# Altium schematic sheet soldeerstation_Schematic.SchDoc: Soldeerstation
size A4; Engineer: Oguzhan Guney
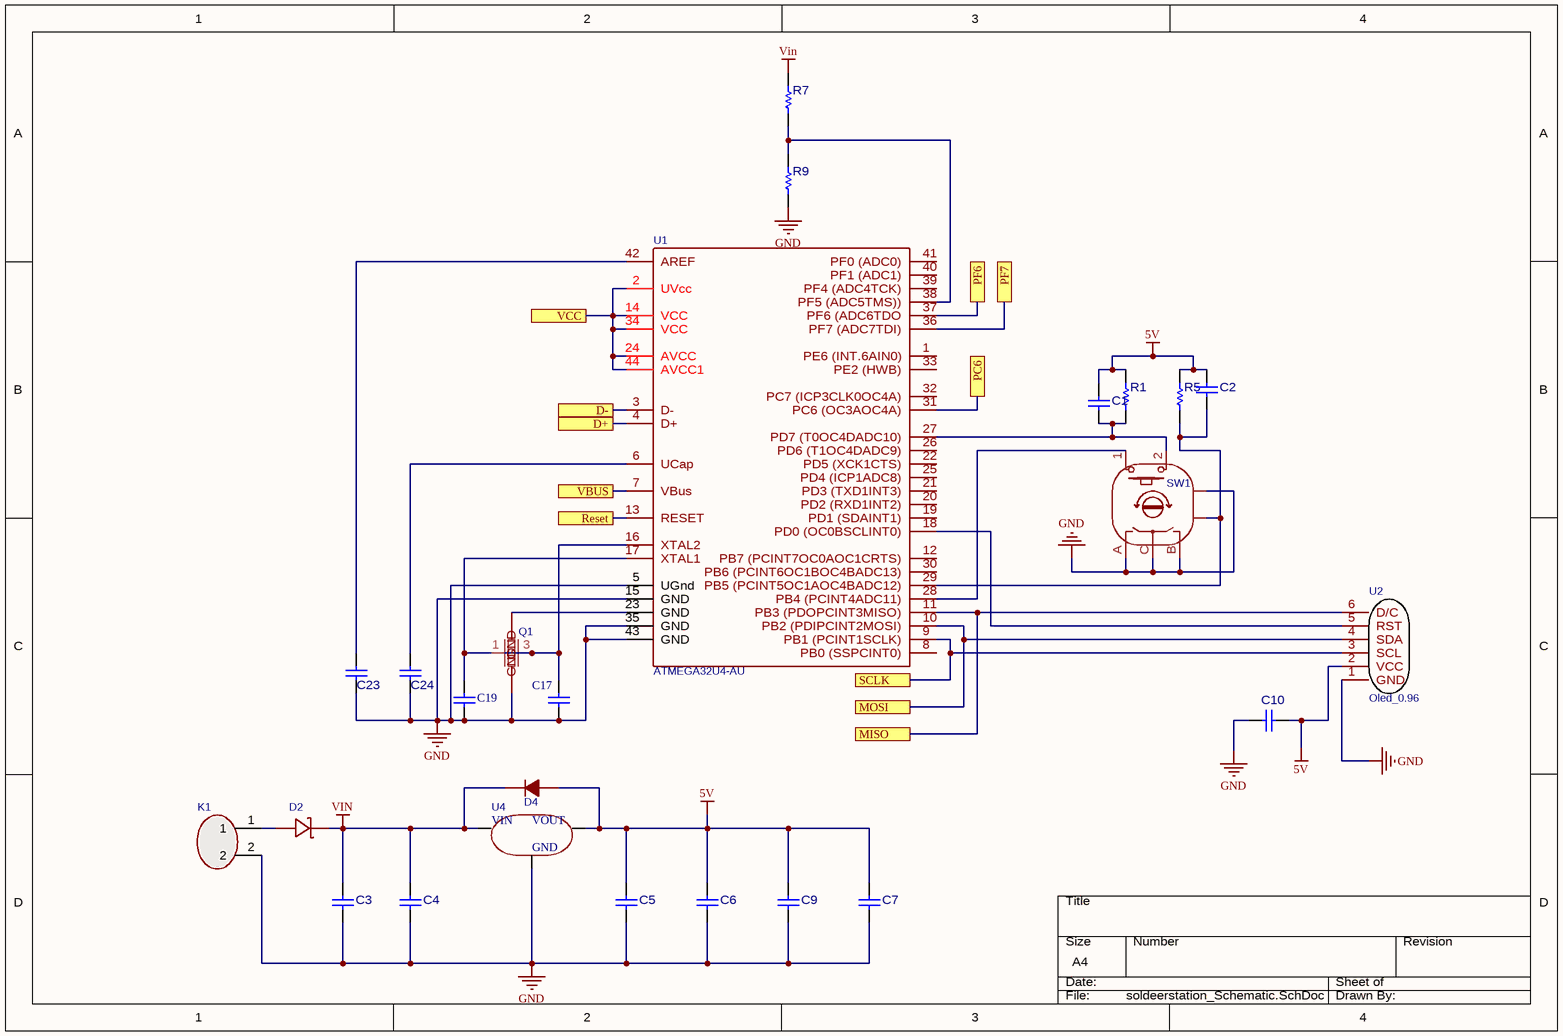
[diagram p0: soldeerstation_Schematic.SchDoc]

## Parts
C1  GRM188R71H103KA01D  [CAPC1608X90X35ML10T15]  (value not drawn)
C2  GRM188R71H103KA01D  [CAPC1608X90X35ML10T15]  (value not drawn)
C3  CL31B106KLHNNNE  [CAPC3216X180X50LL20T30]  (value not drawn)
C4  C0402C104K8PACTU  [CAPC1005X60X30ML05T10]  (value not drawn)
C5  C0402C104K8PACTU  [CAPC1005X60X30ML05T10]  (value not drawn)
C6  CAP 47uF 10V 1206(3216)  [CAPC1206(3216)190_N]  (value not drawn)
C7  C1206C106K8RACTU  [CAPC3216X180X50LL20T25]  (value not drawn)
C9  C0402C104K8PACTU  [CAPC1005X60X30ML05T10]  (value not drawn)
C10  C0402C104K8PACTU  [CAPC1005X60X30ML05T10]  (value not drawn)
C17  CAP 22pF 50V 0805(2012)  [CAPC0805(2012)100_L]  (value not drawn)
C19  CAP 22pF 50V 0805(2012)  [CAPC0805(2012)100_L]  (value not drawn)
C23  C0402C104K8PACTU  [CAPC1005X60X30ML05T10]  (value not drawn)
C24  12061C105KAT2A  [CAPC3216X180X50LL20T25]  (value not drawn)
D2  MBRS540T3G  [SMC]  (value not drawn)
D4  S1A  [SMA(DO-214AC)]  (value not drawn)
K1  WJ25C-B-2P  [WJ25C-B-7.62-2P]  (value not drawn)
Q1  KX-7  [KX-7]  (value not drawn)
R1  RC0603FR-0710KL  [RESC1608X55X25ML10T15]  (value not drawn)
R5  RC0603FR-0710KL  [RESC1608X55X25ML10T15]  (value not drawn)
R7  RC0603FR-0710KL  [RESC1608X55X25ML10T15]  (value not drawn)
R9  ERJ2RKF2701X  [RESC1005X40X25NL05T05]  (value not drawn)
SW1  PEC11R-4015F-S0024  [BOURNS_PEC11R-4XXXF-SXXXX]  (value not drawn)
U1  ATMEGA32U4-AU  [QFP-44_10X10X08P]
U2  Oled_0.96  [OLED_0.96'']
U4  NCP1117ST50T3G  [SOT-223]  (value not drawn)

## Ports
D+, D-, MISO, MOSI, PC6, PF6, PF7, Reset, SCLK, VBUS, VCC

## Nets
5V: C1.2 C2.2 C5.2 C6.2 C7.2 C9.2 C10.1 D4.1(A) R1.2 R5.2 U2.2(VCC) U4.5
GND: C3.1 C4.1 C5.1 C6.1 C7.1 C9.1 C10.2 C17.1 C19.1 C23.1 C24.1 K1.2 Q1.2(GND) R9.1 SW1.A SW1.B SW1.C SW1.MT2 U1.5(UGnd) U1.15(GND) U1.35(GND) U1.43(GND) U2.1(GND) U4.6
VIN: C3.2 C4.2 D2.C D4.2(K) R7.2 U4.4
D+: U1.4(D+) ; port D+
D-: U1.3(D-) ; port D-
MISO: U1.11(PB3_(PDOPCINT3MISO)) U2.6(D/C) ; port MISO
MOSI: U1.10(PB2_(PDIPCINT2MOSI)) U2.4(SDA) ; port MOSI
PC6: U1.31(PC6_(OC3AOC4A)) ; port PC6
PF6: U1.37(PF6_(ADC6TDO) ; port PF6
PF7: U1.36(PF7_(ADC7TDI)) ; port PF7
Reset: U1.13(RESET) ; port Reset
SCLK: U1.9(PB1_(PCINT1SCLK)) U2.3(SCL) ; port SCLK
VBUS: U1.7(VBus) ; port VBUS
VCC: U1.2(UVcc) U1.14(VCC) U1.24(AVCC) U1.34(VCC) U1.44(AVCC1) ; port VCC
NetC1_1: C1.1 R1.1 SW1.2 U1.27(PD7_(T0OC4DADC10))
NetC2_1: C2.1 R5.1 SW1.MT1 U1.29(PB5_(PCINT5OC1AOC4BADC12))
NetC17_2: C17.2 Q1.3 U1.16(XTAL2)
NetC19_2: C19.2 Q1.1 U1.17(XTAL1)
NetC23_2: C23.2 U1.42(AREF)
NetC24_2: C24.2 U1.6(UCap)
NetD2_A: D2.A K1.1
NetQ1_4: Q1.4(GND) U1.23(GND)
NetR7_1: R7.1 R9.2 U1.38(PF5_(ADC5TMS)))
NetSW1_1: SW1.1 U1.28(PB4_(PCINT4ADC11))
NetU1_18: U1.18(PD0_(OC0BSCLINT0)) U2.5(RST)

Not connected (* = marked no-connect by the designer): U1 1(PE6_(INT.6AIN0)) 8(PB0_(SSPCINT0)) 12(PB7_(PCINT7OC0AOC1CRTS)) 19(PD1_(SDAINT1)) 20(PD2_(RXD1INT2)) 21(PD3_(TXD1INT3)) 22(PD5_(XCK1CTS)) 25(PD4_(ICP1ADC8)) 26(PD6_(T1OC4DADC9)) 30(PB6_(PCINT6OC1BOC4BADC13)) 32(PC7_(ICP3CLK0OC4A)) 33(PE2_(HWB)) 39(PF4_(ADC4TCK)) 40(PF1_(ADC1)) 41(PF0_(ADC0))

## Notes on the sheet
- (in symbol NCP1117ST50T3G) VIN; VOUT; GND

## Library data of the parts
C1 C2 = CMP-2100-03642-1: Chip Capacitor, 10 nF, +/- 10%, 50 V, -55 to 125 degC, 0603 (1608 Metric), RoHS, Tape and Reel; Manufacturer: Murata; Insulation Resistance: 10GR; Dielectric: X7R; Voltage Rating: 50V; Capacitance: 10nF; Material: Ceramic; Package Quantity: 1; Lead Free: LeadFree; Case/Package: 0603; Termination: SMD/SMT; REACH SVHC: Unknown; Manufacturer URL: http://www.murata.com/; Datasheet URL: http://search.murata.co.jp/Ceramy/image/img/A01X/G101/ENG/GRM188R71H103KA01-01.pdf; Mount: SurfaceMount; Datasheet Version: 42401.0; Number of Pins: 2; Length: 1.6mm; Voltage: 50V; Depth: 0.8mm; Tolerance: 10%; Min Operating Temperature: -55degC; Voltage Rating (DC): 50V; Max Operating Temperature: 125degC; Package Description: 2-Pin Surface Mount Device, Body 1.6 x 0.8 mm; RoHSCompliant: True; Case Code (Imperial): 0603; Width: 0.031inch; Case Code (Metric): 1608; Height: 0.8mm; Package Reference: 0603; Packaging: TapeandReel; Thickness: 0.035inch; Dielectric Material: Ceramic
C3 = CMP-2000-06108-1: Chip Capacitor, 10 uF, +/- 10%, 35 V, -55 to 125 degC, 1206 (3216 Metric), RoHS, Tape and Reel; Manufacturer: Samsung Electro-Mechanics; Material properties: X7R; Capacity (elec.): 10µF; Nominal voltage: 35V; Content: 2000pc(s); Material: Ceramic; Type: 1206; Industrial packaging: Yes; Mounting Technology: SurfaceMount; Package Reference: 1206; Manufacturer URL: http://www.samsungsem.com/global/index.jsp; Datasheet URL: http://www.samsungsem.com/kr/support/product-search/mlcc/__icsFiles/afieldfile/2016/08/18/S_CL31B106KLHNNNE.pdf; Package Description: 2-Pin Surface Mount Device, Body 3.2 x 1.6 mm; Datasheet Version: 07/2016; Packaging type: Reel; Category: Ceramiccapacitor; Tolerance: 10%
C4 C5 C9 C10 C23 = CMP-2008-02046-1: Manufacturer: Kemet; Part Number: C0402C104K8PACTU
C6 = CMP-1037-05002-1: CAP 47uF 10V ±20% 1206 (3216 Metric) Thickness 1.9mm SMD; Case-Metric: 3216; Case-EIA: 1206; Tolerance: Â±20%; Technology: SMT; Rated Voltage: 10 V; Value: 47uF; Max Thickness: 1.9 mm
C7 = CMP-2000-06013-1: Chip Capacitor, 10 uF, +/- 10%, 10 V, -55 to 125 degC, 1206 (3216 Metric), RoHS, Tape and Reel; Type: SMDMLCCX7R6.3-250VDCCommericalGrade; Class: Class1; Case Height: 1.6mm; Temperature Coefficient / Code: +/-15%; Capacitance: 10uF; Brand: Kemet; Case Length: 3.2mm; Dissipation Factor DF: 5; Voltage Rating: 10V; Dielectric: X7R; Tolerance: 10%; Package Reference: 1206; Dimensions: 1.6mmWx3.2mmLx1.6mmH; Series: C1206C; Minimum Operating Temperature: -55C; RoHS: Details; Termination Style: SMD/SMT; Mounting Technology: SurfaceMount; Manufacturer: Kemet; Product Category: MultilayerCeramicCapacitorsMLCC-SMD/SMT; Case Code - mm: 3216; Manufacturer URL: http://www.kemet.com/; Product: GeneralTypeMLCCs; Package Description: 2-Pin Surface Mount Device, Body 3.2 x 1.6 mm; Case Width: 1.6mm; Factory Pack Quantity: 2000; Package / Case: 1206(3216metric); Datasheet URL: http://www.kemet.com/docfinder?Partnumber=C1206C106K8RACTU; Datasheet Version: 02/2016; Operating Temperature Range: -55Cto+125C; Voltage Rating DC: 10V; Case Code - in: 1206; Maximum Operating Temperature: +125C; Packaging: Reel
C17 C19 = CMP-1036-01245-1: CAP 22pF 50V ±10% 0805 (2012 Metric) Thickness 1mm SMD; Tolerance: Â±10%; Case-EIA: 0805; Case-Metric: 2012; Rated Voltage: 50 V; Technology: SMT; Value: 22pF; Max Thickness: 1 mm
C24 = CMP-2000-05861-1: Chip Capacitor, 1 uF, +/- 10%, 100 V, -55 to 125 degC, 1206 (3216 Metric), RoHS, Tape and Reel; Manufacturer: AVX; Capacitance: 1µF; Dielectric: X7R; Rated Voltage: 100V; Mounting Technology: SurfaceMount; Package Description: 2-Pin Surface Mount Device, Body 3.2 x 1.6 mm; Case Size/Dimension: 1206; Datasheet Version: 07/2016; Manufacturer URL: http://www.avx.com/; Package Reference: 1206; Datasheet URL: http://datasheets.avx.com/X7RDielectric.pdf; Tolerance (%): ±10%
D2 = MBRS540T3G: Manufacturer: ON Semiconductor; nameAlias: Model; Contributor: elnarte; spicePre: D; BOM_Manufacturer Part: ?; spiceSymbolName: MBRS540T3G
D4 = S1A: BOM_Manufacturer: MDD; BOM_Supplier: LCSC; BOM_Manufacturer Part: S1A; image: //image.lceda.cn/szlcsc/C64912.jpg; BOM_Supplier Part: C64912; spicePre: D
K1 = WJ25C-B-2P: BOM_Manufacturer: ReliaPro; BOM_Supplier: LCSC; BOM_Manufacturer Part: WJ25C-B-2P; image: //image.lceda.cn/szlcsc/C8422.jpg; BOM_Supplier Part: C8422; spicePre: P
Q1 = KX-7: BOM_Manufacturer Part: GEYER 32MHz 10/10; Contributor: bazis.ural; spicePre: Q
R1 R5 R7 = CMP-2100-03664-1: Chip Resistor, 10 KOhm, +/- 1%, 01 W, -55 to 155 degC, 0603 (1608 Metric), RoHS, Tape and Reel; Manufacturer: Yageo; Temperature Coefficient: 100ppm/degreesC; Resistance: 10KOhm; Voltage Rating: 75V; Power Rating: 100mW; Voltage Rating (DC): 50V; Composition: ThickFilm; RoHSCompliant: true; Height: 0.45mm; Lead Free: LeadFree; Case Code (Metric): 1608; Case/Package: 0603; Datasheet Version: Rev. 5, 10/2016; Package Reference: 0603; Depth: 0.8mm; Package Description: 2-Pin Surface Mount Device, Body 1.6 x 0.8 mm; Case Code (Imperial): 0603; Packaging: TapeandReel; Termination: SMD/SMT; Lead Pitch: 0.3mm; Width: 0.8mm; Number of Pins: 2; Length: 1.6mm; REACH SVHC: NoSVHC; Military Standard: Not; Max Operating Temperature: 155degC; Min Operating Temperature: -55degC; Manufacturer URL: http://www.yageo.com/; Datasheet URL: http://www.yageo.com/NewPortal/yageodocoutput?fileName=/pdf/R-Chip/PYu-RC_Group_51_RoHS_L_5.pdf; Weight: 7.1E-05oz; Tolerance: 1%
R9 = CMP-2002-01138-1: Manufacturer: Panasonic; Part Number: ERJ2RKF2701X
SW1 = PEC11R-4015F-S0024: BOM_Manufacturer: BOURNS; Contributor: LCSC; BOM_Supplier: LCSC; BOM_Supplier Part: C143789; BOM_Manufacturer Part: PEC11R-4015F-S0024; spicePre: S
U1 = ATMEGA32U4-AU: BOM_Manufacturer: MICROCHIP; BOM_Supplier: LCSC; BOM_Manufacturer Part: ATMEGA32U4-AU; image: //image.lceda.cn/szlcsc/C44854.jpg; BOM_Supplier Part: C44854; spicePre: U
U2 = Oled_0.96: Contributor: Ivan K; BOM_Manufacturer Part: Oled_0.96''; spicePre: U
U4 = NCP1117ST50T3G: BOM_Manufacturer: ON; timeStamp: 1466353290; BOM_Supplier: LCSC; BOM_Manufacturer Part: NCP1117ST50T3G; image: //image.lceda.cn/szlcsc/C17314.jpg; BOM_Supplier Part: C17314; spicePre: U